# EAGLE schematic quad.vca.main (EAGLE 7.5.0)
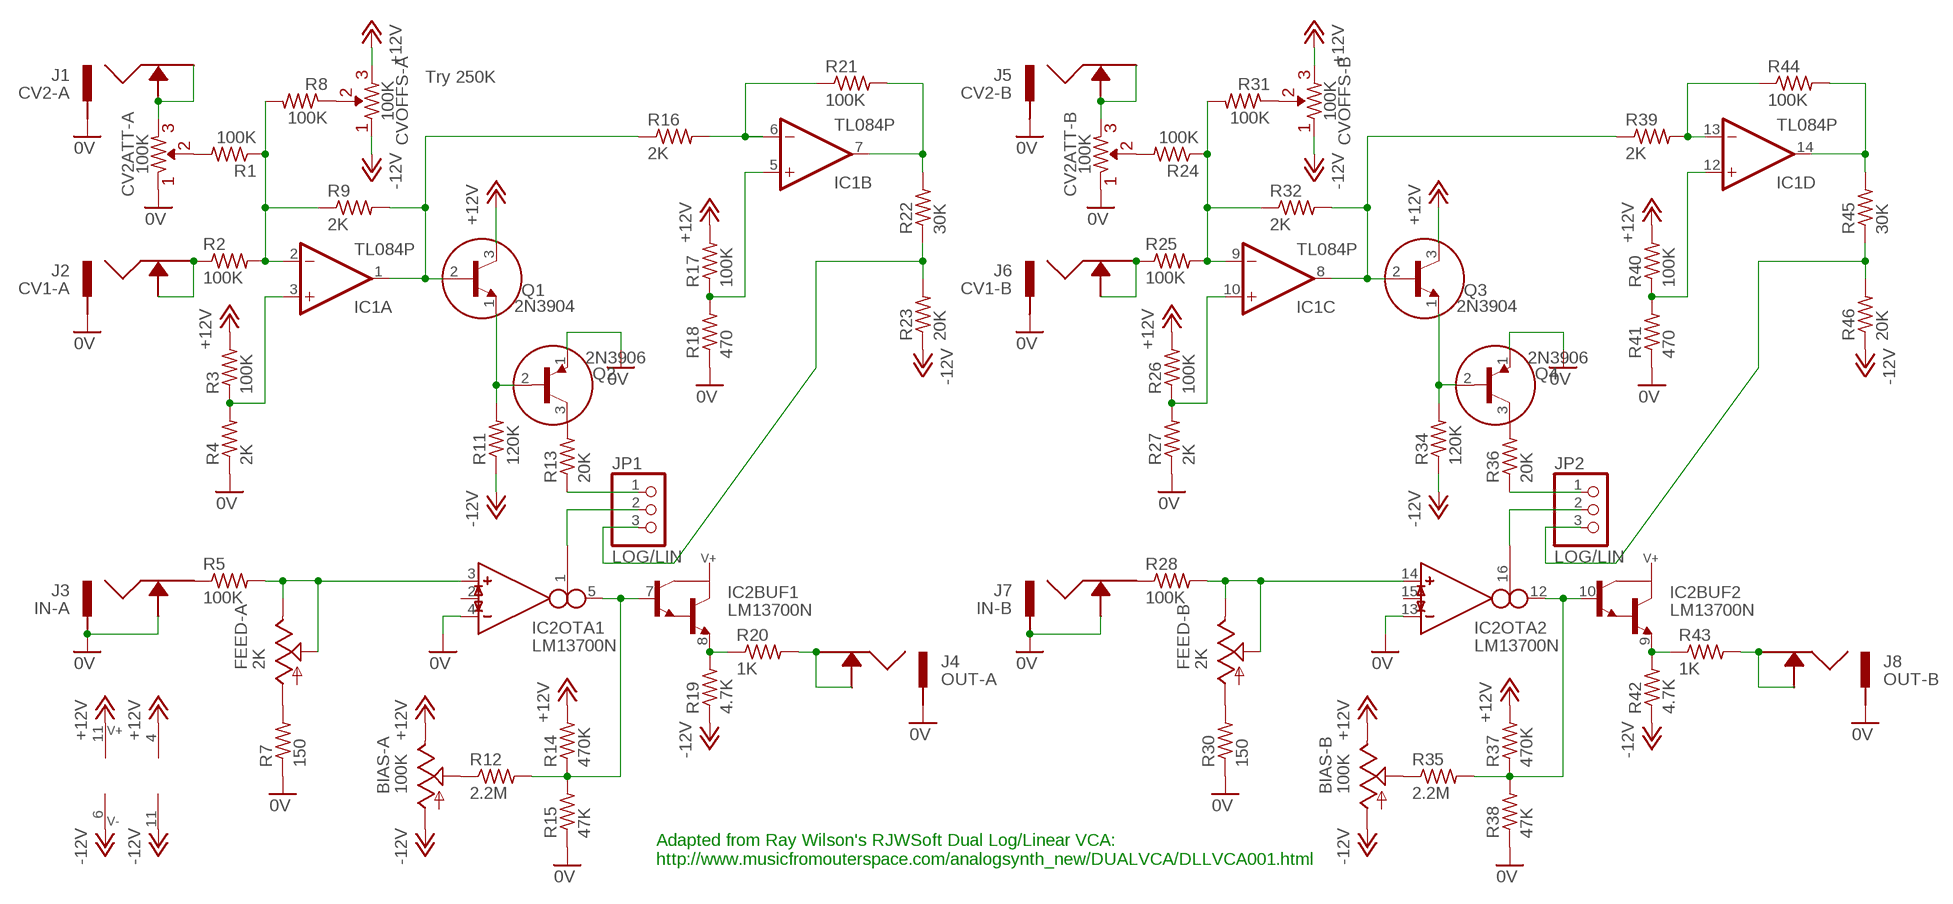
[diagram p0: schematic, sheet 1]

## Parts
BIAS-A  100K  TRIM_US-PT10S  [PT-10S]
BIAS-B  100K  TRIM_US-PT10S  [PT-10S]
CV2ATT-A  100K  R-VAR  [R-VAR]
CV2ATT-B  100K  R-VAR  [R-VAR]
CVOFFS-A  100K  R-VAR  [R-VAR]
CVOFFS-B  100K  R-VAR  [R-VAR]
FEED-A  2K  TRIM_US-PT10S  [PT-10S]
FEED-B  2K  TRIM_US-PT10S  [PT-10S]
IC1  TL084P  [DIL14]
IC2  LM13700N  [DIL16]
J1  CV2-A  ACJM-MV35-2S  [ACJM-MV35-2S]
J2  CV1-A  ACJM-MV35-2S  [ACJM-MV35-2S]
J3  IN-A  ACJM-MV35-2S  [ACJM-MV35-2S]
J4  OUT-A  ACJM-MV35-2S  [ACJM-MV35-2S]
J5  CV2-B  ACJM-MV35-2S  [ACJM-MV35-2S]
J6  CV1-B  ACJM-MV35-2S  [ACJM-MV35-2S]
J7  IN-B  ACJM-MV35-2S  [ACJM-MV35-2S]
J8  OUT-B  ACJM-MV35-2S  [ACJM-MV35-2S]
JP1  LOG/LIN  PINHD-1X3  [1X03]
JP2  LOG/LIN  PINHD-1X3  [1X03]
Q1  2N3904  [TO92]
Q2  2N3906  [TO92]
Q3  2N3904  [TO92]
Q4  2N3906  [TO92]
R1  100K  R-US_0207/7  [0207/7]
R2  100K  R-US_0207/7  [0207/7]
R3  100K  R-US_0207/7  [0207/7]
R4  2K  R-US_0207/7  [0207/7]
R5  100K  R-US_0207/7  [0207/7]
R7  150  R-US_0207/7  [0207/7]
R8  100K  R-US_0207/7  [0207/7]
R9  2K  R-US_0207/7  [0207/7]
R11  120K  R-US_0207/7  [0207/7]
R12  2.2M  R-US_0207/7  [0207/7]
R13  20K  R-US_0207/7  [0207/7]
R14  470K  R-US_0207/7  [0207/7]
R15  47K  R-US_0207/7  [0207/7]
R16  2K  R-US_0207/7  [0207/7]
R17  100K  R-US_0207/7  [0207/7]
R18  470  R-US_0207/7  [0207/7]
R19  4.7K  R-US_0207/7  [0207/7]
R20  1K  R-US_0207/7  [0207/7]
R21  100K  R-US_0207/7  [0207/7]
R22  30K  R-US_0207/7  [0207/7]
R23  20K  R-US_0207/7  [0207/7]
R24  100K  R-US_0207/7  [0207/7]
R25  100K  R-US_0207/7  [0207/7]
R26  100K  R-US_0207/7  [0207/7]
R27  2K  R-US_0207/7  [0207/7]
R28  100K  R-US_0207/7  [0207/7]
R30  150  R-US_0207/7  [0207/7]
R31  100K  R-US_0207/7  [0207/7]
R32  2K  R-US_0207/7  [0207/7]
R34  120K  R-US_0207/7  [0207/7]
R35  2.2M  R-US_0207/7  [0207/7]
R36  20K  R-US_0207/7  [0207/7]
R37  470K  R-US_0207/7  [0207/7]
R38  47K  R-US_0207/7  [0207/7]
R39  2K  R-US_0207/7  [0207/7]
R40  100K  R-US_0207/7  [0207/7]
R41  470  R-US_0207/7  [0207/7]
R42  4.7K  R-US_0207/7  [0207/7]
R43  1K  R-US_0207/7  [0207/7]
R44  100K  R-US_0207/7  [0207/7]
R45  30K  R-US_0207/7  [0207/7]
R46  20K  R-US_0207/7  [0207/7]

## Nets
0V: CV2ATT-A.R1 CV2ATT-B.R1 IC2.4(OTA1:IN_N) IC2.13(OTA2:IN_N) J1.P$1 J2.P$1 J3.P$1 J3.P$2 J4.P$1 J5.P$1 J6.P$1 J7.P$1 J7.P$2 J8.P$1 Q2.1(E) Q4.1(E) R4.1 R7.1 R15.1 R18.1 R27.1 R30.1 R38.1 R41.1
+12V: BIAS-A.E BIAS-B.E CVOFFS-A.R2 CVOFFS-B.R2 IC1.4(P:V+) IC2.11(SUPPLY:V+) Q1.3(C) Q3.3(C) R3.2 R14.2 R17.2 R26.2 R37.2 R40.2
-12V: BIAS-A.A BIAS-B.A CVOFFS-A.R1 CVOFFS-B.R1 IC1.11(P:V-) IC2.6(SUPPLY:V-) R11.1 R19.1 R23.1 R34.1 R42.1 R46.1
N$1: J2.P$2 J2.P$3 R2.1
N$2: J4.P$2 J4.P$3 R20.2
N$3: IC1.3(A:+IN) R3.1 R4.2
N$4: IC1.2(A:-IN) R1.1 R2.2 R8.2 R9.1
N$5: CVOFFS-A.VAR R8.1
N$6: IC1.1(A:OUT) Q1.2(B) R9.2 R16.1
N$7: Q1.1(E) Q2.2(B) R11.2
N$8: FEED-A.A R7.2
N$9: Q2.3(C) R13.2
N$10: JP1.1 R13.1
N$11: J3.P$3 R5.1
N$12: FEED-A.E FEED-A.S IC2.3(OTA1:IN_P) R5.2
N$13: IC2.8(BUF1:E) R19.2 R20.1
N$14: BIAS-A.S R12.1
N$15: IC2.5(OTA1:OUT) IC2.7(BUF1:B) R12.2 R14.1 R15.2
N$16: CV2ATT-A.R2 J1.P$2 J1.P$3
N$17: CV2ATT-A.VAR R1.2
N$18: JP1.3 R22.1 R23.2
N$19: IC1.5(B:+IN) R17.1 R18.2
N$20: IC1.6(B:-IN) R16.2 R21.1
N$21: IC2.1(OTA1:I_BIAS) JP1.2
N$22: IC1.7(B:OUT) R21.2 R22.2
N$23: J6.P$2 J6.P$3 R25.1
N$24: J8.P$2 J8.P$3 R43.2
N$25: IC1.10(C:+IN) R26.1 R27.2
N$26: IC1.9(C:-IN) R24.1 R25.2 R31.2 R32.1
N$27: CVOFFS-B.VAR R31.1
N$28: IC1.8(C:OUT) Q3.2(B) R32.2 R39.1
N$29: Q3.1(E) Q4.2(B) R34.2
N$30: Q4.3(C) R36.2
N$31: FEED-B.A R30.2
N$32: J7.P$3 R28.1
N$33: FEED-B.E FEED-B.S IC2.14(OTA2:IN_P) R28.2
N$34: BIAS-B.S R35.1
N$35: IC2.10(BUF2:B) IC2.12(OTA2:OUT) R35.2 R37.1 R38.2
N$36: IC2.9(BUF2:E) R42.2 R43.1
N$37: CV2ATT-B.R2 J5.P$2 J5.P$3
N$38: CV2ATT-B.VAR R24.2
N$39: IC1.12(D:+IN) R40.1 R41.2
N$40: IC1.13(D:-IN) R39.2 R44.1
N$41: IC1.14(D:OUT) R44.2 R45.2
N$42: JP2.1 R36.1
N$43: JP2.3 R45.1 R46.2
N$44: IC2.16(OTA2:I_BIAS) JP2.2
Unconnected: IC2.2(OTA1:I_DIODE) IC2.15(OTA2:I_DIODE)

## Notes on the sheet
- Try 250K
- Adapted from Ray Wilson's RJWSoft Dual Log/Linear VCA:
  http://www.musicfromouterspace.com/analogsynth_new/DUALVCA/DLLVCA001.html

## Library data of the parts
BIAS-A BIAS-B FEED-A FEED-B = pot:TRIM_US-: POTENTIOMETER
CV2ATT-A CV2ATT-B CVOFFS-A CVOFFS-B = _common:R-VAR
IC1 = linear:TL084: OP AMP
IC2 = ota:LM13700: Dual OTA with buffers
J1-J8 = jacks:ACJM-MV35-2S: Amphenol 3.5mm Jack (Vertical) ACJM-MV35-2S http://ca.mouser.com/Search/ProductDetail.aspx?R=ACJM-MV35-2Svirtualkey52380000virtualkey523-ACJMMV352S
JP1 JP2 = pinhead:PINHD-1X3: PIN HEADER
Q1 Q3 = _common:2N3904
Q2 Q4 = _common:2N3906: PNP Transistor
R1-R5 R7-R9 R11-R28 R30-R32 R34-R46 = resistor:R-US_: RESISTOR, American symbol